# Altium project QUTMS-AltiumCommonProject.PrjPcb
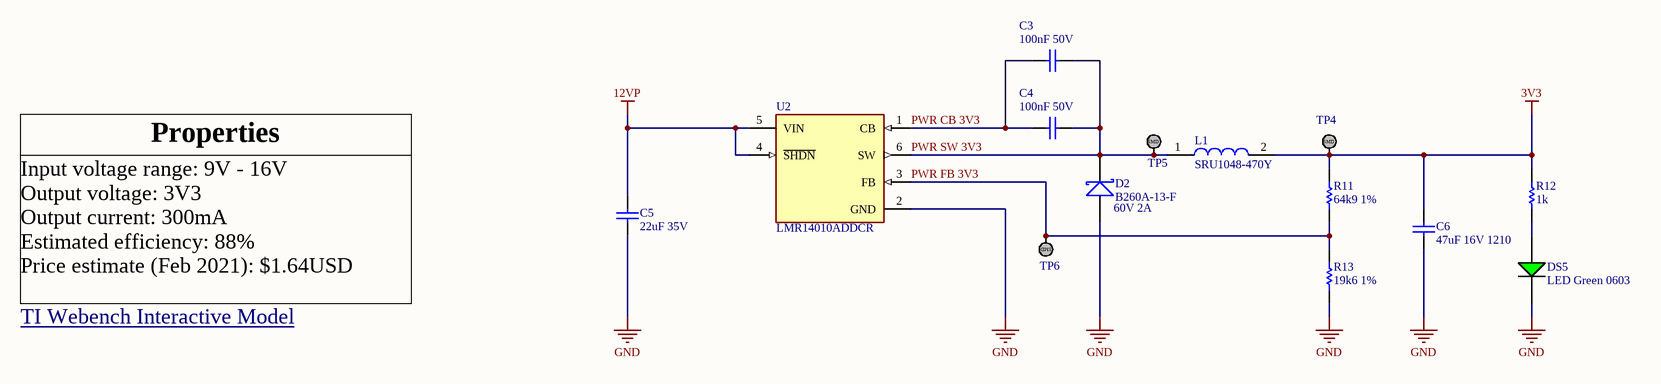
[diagram p0: PSU3V3-300mA.SchDoc]
4 sheets, 64 parts. Net scope: hierarchical (ports join the sheet entries above them; power ports are global).
Sheets:
  PSU3V3-300mA.SchDoc
  PSU5V-400mA.SchDoc
  PSU12V-250mA-Protection.SchDoc
    U_CAN-Transceiver = CAN-Transceiver.SchDoc

## Sheet PSU3V3-300mA.SchDoc: 9-16V to 3V3 - 300mA
size A3; DrawnBy: Tom Benedetti (Based on Jonn Dillon); DocumentNumber: 1; Revision: 03; SheetNumber: 1; SheetTotal: 1; Version: 01; Project: QUTMS Common Altium Schematics; PageSetup: Record=PageOptions|CenterHorizontal=True|CenterVertical=True|PrintScale=0.97|XCorrection=1.00|YCorrection=1.00|PrintKind=0|BorderSize=5000000|LeftOffset=0|BottomOffset=0|Orientation=2|PaperLength=1000|PaperWidth=1000|Scale=100|PaperSource=7|PrintQuality=-4|MediaType=1|DitherType=10|PaperKind=A4|PrintScaleMode=1

### Parts
C3  100nF 50V  [Cap_Ceramic_0603]
C4  100nF 50V  [Cap_Ceramic_0603]
C5  22uF 35V  [Cap_Ceramic_1206]
C6  47uF 16V 1210  [Cap_Ceramic_1210]
D2  B260A-13-F  [SMA]
DS5  LED Green 0603  [LED GREEN 0603]
L1  SRU1048-470Y  [SRU1048]
R11  64k9 1%  [Res_ThinFilm_0603]
R12  1k  [Res_ThinFilm_0603]
R13  19k6 1%  [Res_ThinFilm_0603]
TP4  TestPoint_SMD  [TestPointSMD]  (value not drawn)
TP5  TestPoint_SMD  [TestPointSMD]  (value not drawn)
TP6  TestPoint_SMD  [TestPointSMD]  (value not drawn)
U2  LMR14010ADDCR  [FP-DDC0006A-MFG]

### Nets
3V3: C6.2 L1.2 R11.2 R12.2 TP4.1
12VP: C5.1 U2.4(~{SHDN}) U2.5(VIN)
GND: C5.2 C6.1 D2.A DS5.2(C) R13.1 U2.2(GND)
PWR CB 3V3: C3.1 C4.1 U2.1(CB)
PWR FB 3V3: R11.1 R13.2 TP6.1 U2.3(FB)
PWR SW 3V3: C3.2 C4.2 D2.K L1.1 TP5.1 U2.6(SW)
NetDS5_1: DS5.1(A) R12.1

### Notes on the sheet
- Properties
- (near D2) 60V 2A
- Input voltage range: 9V - 16V
  Output voltage: 3V3
  Output current: 300mA
  Estimated efficiency: 88%
  Price estimate (Feb 2021): $1.64USD
- TI Webench Interactive Model <https://webench.ti.com/power-designer/switching-regulator/customize/16?O1I=0.3&O1V=3.3&VinMax=16.0&VinMin=9.0&action=schematic&base_pn=LMR14010A&lang_chosen=en_US&op_TA=30.0&optFactor=3&origin=ODS__LMR14010A>
- Revision History:
- Sheet Title:
- Rev
- Date
- Description
- Project:
- Size:
- Drawn By:
- A3
- Number:
- Revision:
- Sheet
- Version:
- of
- QUT Motorsport
- O-120, Gardens Point
- 2 George Street
- Brisbane, QLD 4000
- Australia
- Print Date:
- Print Time:
- File Name:
- (in symbol TestPoint_SMD) SMD

### Library data of the parts
C3 C4 = 100nF 50V 5% X7R 0603: Capacitor, Ceramic, SMD, 100nF, 50V, 5%, X7R, 0603
C5 = 22uF 35V 20% X5R 1206: 22µF ±20% 35V Ceramic Capacitor X5R 1206 (3216 Metric); ComponentLink1Description: Digikey; ComponentLink1URL: https://www.digikey.com.au/product-detail/en/tdk-corporation/C3216X5R1V226M160AC/445-8045-1-ND/2792165; ComponentLink2Description: Datasheet; ComponentLink2URL: https://product.tdk.com/info/en/catalog/datasheets/mlcc_commercial_general_en.pdf
C6 = 47uF 16V 10% X7R 1210: Capacitor, Ceramic, SMD, 47uF, 16V, 5%, X7R, 1210
D2 = B260A-13-F: Diode, Schottky Barrier Rectifier, 60 V, 2 A, B260A-13-F
L1 = SRU1048-470Y: Fixed Inductors 47uH 30% SMD 1048
R11 = 64k9 1% 0603: Resistor, SMD, 64k9, 0.1W, 5%, 0603
R12 = 1k 5% 0603: Resistor, SMD, 1k, 0.1W, 5%, 0603
R13 = 19k6 1% 0603: Resistor, SMD, 19k6, 0.1W, 5%, 0603
U2 = CMP-04918-000056-1: IC REG BUCK ADJ 1A TSOT23-6; Manufacturer: Texas Instruments; Max Junction Temp: +125°C; Number Of Outputs: 1; Standoff Height: 0mm; Switching Frequency: 700kHz; Min Supply Voltage: 4V; Max Supply Voltage: 40V; Max Duty Cycle: 96%; Output Type: AdjustableProgrammable; Manufacturer Part Number: LMR14010ADDCR; Temperature: -40°C to +125°C; Output Current: 1A; Category: IC; Temperature Range High: +125°C; Lead Free: Yes; Switching Topology: Buck; Mouser Description: 4-V to 40-V, 1-A Step-Down Converter With High Efficiency Eco-Mode 6-SOT-23-THIN -40 to 125; Device Class L1: Integrated Circuits (ICs); Digikey Description: IC REG BUCK ADJ 1A TSOT23-6; Package: DDC0006A; Ipc Land Pattern Name: SOT95P280X110-6; Device Class L2: Power Management ICs; Temperature Range Low: -40°C; Height: 1.1mm; Device Class L3: Voltage Regulators - Switching; RoHS: TRUE; Automotive: No; Octopart: https://octopart.com/lmr14010addcr-texas+instruments-90753290; ComponentLink2URL: https://www.ti.com/lit/ds/symlink/lmr14010a.pdf; ComponentLink2Description: Datasheet

## Sheet PSU5V-400mA.SchDoc: 9-16V to 5V - 400mA
size A3; DrawnBy: Tom Benedetti (Based on Jonn Dillon); DocumentNumber: N/A; Revision: 02; SheetNumber: 1; SheetTotal: 1; Version: 01; Project: QUTMS Common Altium Schematics; PageSetup: Record=PageOptions|CenterHorizontal=True|CenterVertical=True|PrintScale=0.97|XCorrection=1.00|YCorrection=1.00|PrintKind=0|BorderSize=5000000|LeftOffset=0|BottomOffset=0|Orientation=2|PaperLength=1000|PaperWidth=1000|Scale=100|PaperSource=7|PrintQuality=-4|MediaType=1|DitherType=10|PaperKind=A4|PrintScaleMode=1
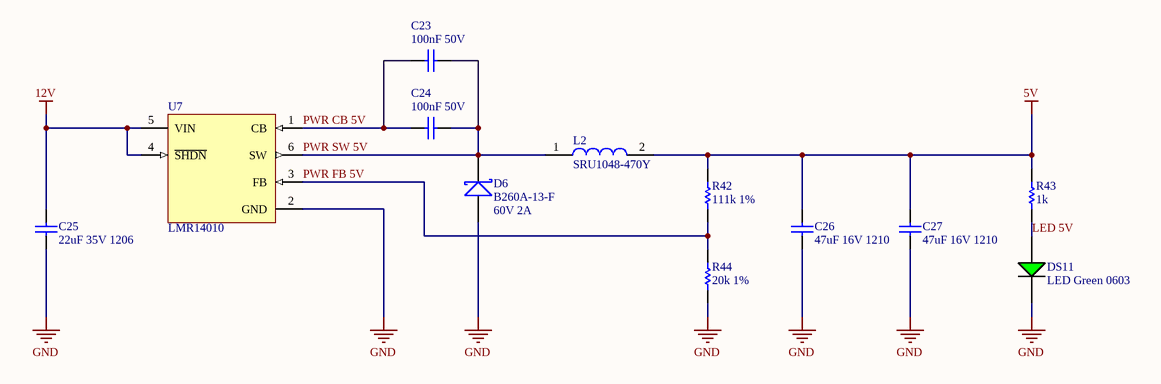
[diagram p1: PSU5V-400mA.SchDoc]

### Parts
C23  100nF 50V  [Cap_Ceramic_0603]
C24  100nF 50V  [Cap_Ceramic_0603]
C25  22uF 35V 1206  [Cap_Ceramic_1206]
C26  47uF 16V 1210  [Cap_Ceramic_1210]
C27  47uF 16V 1210  [Cap_Ceramic_1210]
D6  B260A-13-F  [SMA]
DS11  LED Green 0603  [LED GREEN 0603]
L2  SRU1048-470Y  [SRU1048]
R42  111k 1%  [Res_ThinFilm_0603]
R43  1k  [Res_ThinFilm_0603]
R44  20k 1%  [Res_ThinFilm_0603]
U7  LMR14010  [LMR14010]

### Nets
5V: C26.2 C27.2 L2.2 R42.2 R43.2
12V: C25.2 U7.4(~{SHDN}) U7.5(VIN)
GND: C25.1 C26.1 C27.1 D6.A DS11.2(C) R44.1 U7.2(GND)
LED 5V: DS11.1(A) R43.1
PWR CB 5V: C23.1 C24.1 U7.1(CB)
PWR FB 5V: R42.1 R44.2 U7.3(FB)
PWR SW 5V: C23.2 C24.2 D6.K L2.1 U7.6(SW)

### Notes on the sheet
- (near D6) 60V 2A
- Revision History:
- Sheet Title:
- Rev
- Date
- Description
- Project:
- Size:
- Drawn By:
- A3
- Number:
- Revision:
- Sheet
- Version:
- of
- QUT Motorsport
- O-120, Gardens Point
- 2 George Street
- Brisbane, QLD 4000
- Australia
- Print Date:
- Print Time:
- File Name:

### Library data of the parts
C23 C24 = 100nF 50V 5% X7R 0603: as C3 on sheet PSU3V3-300mA
C25 = 22uF 35V 10% X7R 1206: Capacitor, Ceramic, SMD, 22uF, 35V, 10%, X7R, 1206
C26 C27 = 47uF 16V 10% X7R 1210: as C6 on sheet PSU3V3-300mA
D6 = B260A-13-F: as D2 on sheet PSU3V3-300mA
L2 = SRU1048-470Y: Fixed Inductors 47uH 30% SMD 1048
R42 = 111k 1% 0603: Resistor, SMD, 111k, 0.1W, 5%, 0603
R43 = 1k 5% 0603: Resistor, SMD, 1k, 0.1W, 5%, 0603
R44 = 20k 1% 0603: Resistor, SMD, 20k, 0.1W, 1%, 0603

## Sheet PSU12V-250mA-Protection.SchDoc: 12V 250mA Protection
size A3; DrawnBy: Tom Benedetti; DocumentNumber: N/A; Revision: 3; SheetNumber: 1; SheetTotal: 1; Version: 01; Project: QUTMS Common Altium Schematics; PageSetup: Record=PageOptions|CenterHorizontal=True|CenterVertical=True|PrintScale=0.97|XCorrection=1.00|YCorrection=1.00|PrintKind=0|BorderSize=5000000|LeftOffset=0|BottomOffset=0|Orientation=2|PaperLength=1000|PaperWidth=1000|Scale=100|PaperSource=7|PrintQuality=-4|MediaType=1|DitherType=10|PaperKind=A4|PrintScaleMode=1
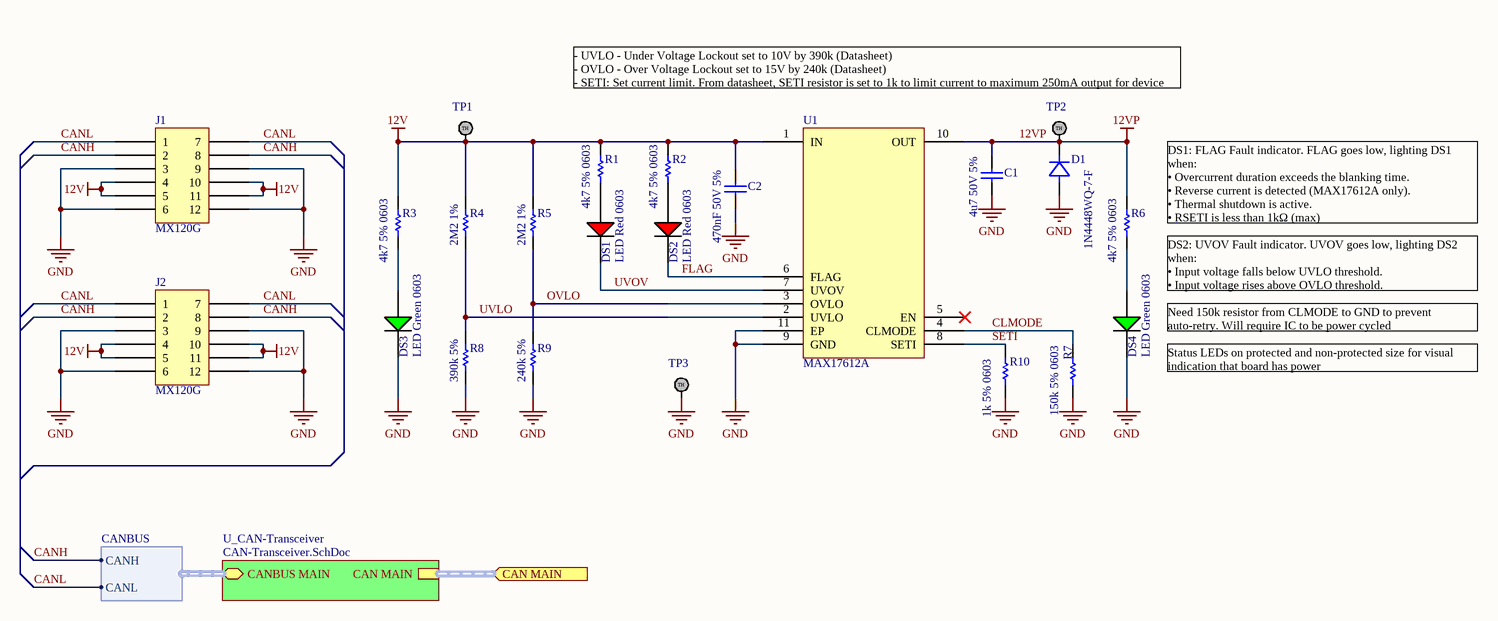
[diagram p2: PSU12V-250mA-Protection.SchDoc]

### Parts
C1  4u7 50V 5%  [Cap_Ceramic_0603]
C2  470nF 50V 5%  [Cap_Ceramic_0603]
D1  1N4448WQ-7-F  [SMA]
DS1  LED Red 0603  [LED RED 0603]
DS2  LED Red 0603  [LED RED 0603]
DS3  LED Green 0603  [LED GREEN 0603]
DS4  LED Green 0603  [LED GREEN 0603]
J1  MX120G  [MX120G]
J2  MX120G  [MX120G]
R1  4k7 5% 0603  [Res_ThinFilm_0603]
R2  4k7 5% 0603  [Res_ThinFilm_0603]
R3  4k7 5% 0603  [Res_ThinFilm_0603]
R4  2M2 1%  [Res_ThinFilm_0603]
R5  2M2 1%  [Res_ThinFilm_0603]
R6  4k7 5% 0603  [Res_ThinFilm_0603]
R7  150k 5% 0603  [Res_ThinFilm_0603]
R8  390k 5%  [Res_ThinFilm_0603]
R9  240k 5%  [Res_ThinFilm_0603]
R10  1k 5% 0603  [Res_ThinFilm_0603]
TP1  TestPoint  [TestPoint]  (value not drawn)
TP2  TestPoint  [TestPoint]  (value not drawn)
TP3  TestPoint  [TestPoint]  (value not drawn)
U1  MAX17612A  [10-Pin TDFN EP]

### Sub-sheets
U_CAN-Transceiver = CAN-Transceiver.SchDoc: CANBUS MAIN (bidir, harness CANBUS), CAN MAIN (harness CAN)

### Ports
CAN MAIN (in)

### Harnesses
CANBUS: CANH, CANL

### Nets
12V: C2.2 J1.4 J1.5 J1.10 J1.11 J2.4 J2.5 J2.10 J2.11 R1.2 R2.2 R3.2 R4.2 R5.2 TP1.1 U1.1(IN)
12VP: C1.2 D1.K(Cathode) R6.2 TP2.1 U1.10(OUT)
GND: C1.1 C2.1 D1.A(Anode) DS3.2(C) DS4.2(C) J1.3 J1.6 J1.9 J1.12 J2.3 J2.6 J2.9 J2.12 R7.1 R8.1 R9.1 R10.1 TP3.1 U1.9(GND) U1.11(EP)
CANH: J1.2 J1.8 J2.2 J2.8 ; sheet U_CAN-Transceiver/CANBUS MAIN.CANH
CANL: J1.1 J1.7 J2.1 J2.7 ; sheet U_CAN-Transceiver/CANBUS MAIN.CANL
CLMODE: R7.2 U1.4(CLMODE)
FLAG: DS2.2(C) U1.6(FLAG)
OVLO: R5.1 R9.2 U1.3(OVLO)
SETI: R10.2 U1.8(SETI)
UVLO: R4.1 R8.2 U1.2(UVLO)
UVOV: DS1.2(C) U1.7(UVOV)
NetDS1_1: DS1.1(A) R1.1
NetDS2_1: DS2.1(A) R2.1
NetDS3_1: DS3.1(A) R3.1
NetDS4_1: DS4.1(A) R6.1

Not connected (* = marked no-connect by the designer): U1 5(EN)*

### Buses and harness runs
harness port CAN MAIN = sheet U_CAN-Transceiver/CAN MAIN

### Notes on the sheet
- - UVLO - Under Voltage Lockout set to 10V by 390k (Datasheet)
  - OVLO - Over Voltage Lockout set to 15V by 240k (Datasheet)
  - SETI: Set current limit. From datasheet, SETI resistor is set to 1k to limit current to maximum 250mA output for device
- (near R6) DS1: FLAG Fault indicator. FLAG goes low, lighting DS1 when:
  • Overcurrent duration exceeds the blanking time.
  • Reverse current is detected (MAX17612A only).
  • Thermal shutdown is active.
  • RSETI is less than 1kΩ (max)
- DS2: UVOV Fault indicator. UVOV goes low, lighting DS2 when:
  • Input voltage falls below UVLO threshold.
  • Input voltage rises above OVLO threshold.
- (near DS4) Need 150k resistor from CLMODE to GND to prevent auto-retry. Will require IC to be power cycled
- (near DS4) Status LEDs on protected and non-protected size for visual indication that board has power
- Revision History:
- Sheet Title:
- Rev
- Date
- Description
- Project:
- Size:
- Drawn By:
- A3
- Number:
- Revision:
- Sheet
- Version:
- of
- QUT Motorsport
- O-120, Gardens Point
- 2 George Street
- Brisbane, QLD 4000
- Australia
- Print Date:
- Print Time:
- File Name:
- (in symbol TestPoint) TH

### Library data of the parts
C1 = 4u7 50V 5% X7R 0603: Capacitor, Ceramic, SMD, 4u7, 50V, 5%, X7R, 0603
C2 = 470nF 50V 5% X7R 0603: Capacitor, Ceramic, SMD, 470nF, 50V, 5%, X7R, 0603
D1 = 1N4448WQ-7-F: Diode, SMD, 75V, 5%, 250mA, SOD123; Manufacturer: ON Semiconductor / Fairchild; Manufacturer Part Number: 1N914BWS; Average Rectified Current: 150mA; Element Configuration: Single; Forward Voltage: 1V; Max Reverse Leakage Current: 5uA; Power Dissipation: 200mW; Recovery Time: 4ns; Max Forward Surge Current (Ifsm): 4A; Parameter 1: *; Weight: 0.0276g; Category: Rectifier Diodes; Contact Plating: Tin,Matte; Forward Current: 150mA; Lead Free: Lead Free; Max Operating Temperature: 150°C; Max Repetitive Reverse Voltage (Vrrm): 75V; Max Reverse Voltage (DC): 75V; Min Operating Temperature: -55°C; Mount: Surface Mount; Number of Pins: 2; Package Quantity: 1; Packaging: Tape and Reel; Peak Reverse Current: 5uA; Radiation Hardening: No; REACH SVHC: No SVHC; Reverse Recovery Time: 4ns; Height: 1mm; Length: 1.8mm; Reverse Voltage: 75V; Width: 1.35mm
J1 J2 = MX120G: MX120G with standard connector layout
R1-R3 R6 = 4k7 5% 0603: Resistor, SMD, 4k7, 0.1W, 5%, 0603
R4 R5 = 2M2 1% 0603: Resistor, SMD, 2M2, 0.125W, 1%, 0603
R7 = 150k 5%, 0603: Resistor, SMD, 150k, 0.1W, 5%, 0603
R8 = 390k 5% 0603: Resistor, SMD, 390k, 0.1W, 5%, 0603
R9 = 240k 5% 0603: Resistor, SMD, 240k, 0.1W, 5%, 0603
R10 = 1k 5% 0603: Resistor, SMD, 1k, 0.1W, 5%, 0603
U1 = MAX17612A: 4.5V to 60V, 250mA Current-Limiter with OV, UV, and Reverse Protection; ComponentLink1Description: Datasheet; ComponentLink1URL: https://datasheets.maximintegrated.com/en/ds/MAX17612A-MAX17612C.pdf

## Sheet CAN-Transceiver.SchDoc: CAN Transceiver 3V3
size A3; DrawnBy: Jonn Dillon; DocumentNumber: N/A; Revision: 02; SheetNumber: 1; SheetTotal: 1; Version: 01; Project: QUTMS Common Altium Schematics; PageSetup: Record=PageOptions|CenterHorizontal=True|CenterVertical=True|PrintScale=0.97|XCorrection=1.00|YCorrection=1.00|PrintKind=0|BorderSize=5000000|LeftOffset=0|BottomOffset=0|Orientation=2|PaperLength=1000|PaperWidth=1000|Scale=100|PaperSource=7|PrintQuality=-4|MediaType=1|DitherType=10|PaperKind=A4|PrintScaleMode=1
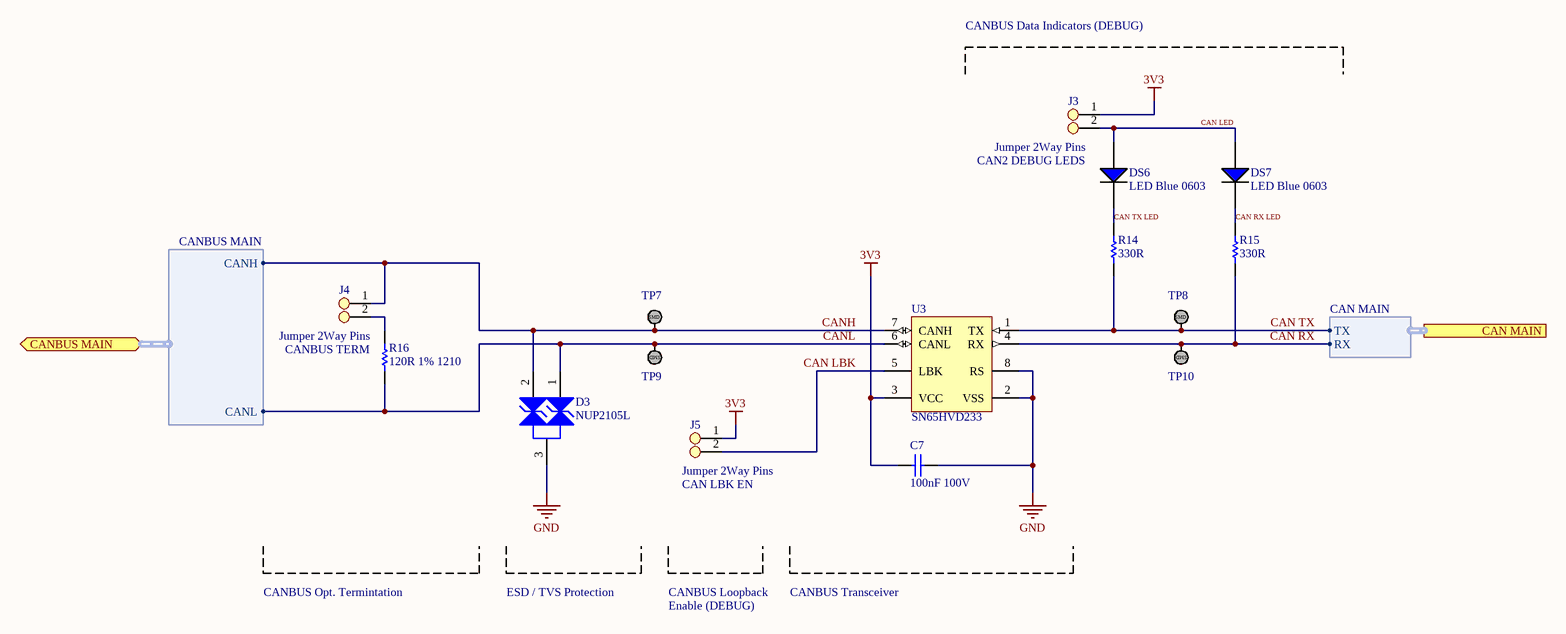
[diagram p3: CAN-Transceiver.SchDoc]

### Parts
C7  100nF 100V  [Cap_Ceramic_0603]
D3  NUP2105L  [NUP2105L]
DS6  LED Blue 0603  [LED BLUE 0603]
DS7  LED Blue 0603  [LED BLUE 0603]
J3  Jumper 2Way Pins  [Jumper_2Way_Pin]
J4  Jumper 2Way Pins  [Jumper_2Way_Pin]
J5  Jumper 2Way Pins  [Jumper_2Way_Pin]
R14  330R  [Res_ThinFilm_0603]
R15  330R  [Res_ThinFilm_0603]
R16  120R 1% 1210  [Res_ThinFilm_1210]
TP7  TestPoint_SMD  [TestPointSMD]  (value not drawn)
TP8  TestPoint_SMD  [TestPointSMD]  (value not drawn)
TP9  TestPoint_SMD  [TestPointSMD]  (value not drawn)
TP10  TestPoint_SMD  [TestPointSMD]  (value not drawn)
U3  SN65HVD233  [SN65HVD233DR]

### Ports
CAN MAIN (harness CAN MAIN), CANBUS MAIN (bidir, harness CANBUS MAIN)

### Harnesses
CANBUS MAIN: CANH, CANL
CAN MAIN: RX, TX

### Nets
3V3: C7.2 J3.1 J5.1 U3.3(VCC)
GND: C7.1 D3.3 U3.2(VSS) U3.8(RS)
CAN LBK: J5.2 U3.5(LBK)
CAN LED: DS6.1(A) DS7.1(A) J3.2
CAN RX: R15.1 TP10.1 U3.4(RX) ; port CAN MAIN.RX
CAN RX LED: DS7.2(C) R15.2
CAN TX: R14.1 TP8.1 U3.1(TX) ; port CAN MAIN.TX
CAN TX LED: DS6.2(C) R14.2
CANH: D3.2 J4.1 TP7.1 U3.7(CANH) ; port CANBUS MAIN.CANH
CANL: D3.1 R16.1 TP9.1 U3.6(CANL) ; port CANBUS MAIN.CANL
NetJ4_2: J4.2 R16.2

### Notes on the sheet
- CANBUS Data Indicators (DEBUG)
- CAN2 DEBUG LEDS
- (near R16) CANBUS TERM
- (near J5) CAN LBK EN
- CANBUS Opt. Termintation
- ESD / TVS Protection
- CANBUS Loopback
- Enable (DEBUG)
- CANBUS Transceiver
- Revision History:
- Sheet Title:
- Rev
- Date
- Description
- Project:
- Size:
- Drawn By:
- A3
- Number:
- Revision:
- Sheet
- Version:
- of
- QUT Motorsport
- O-120, Gardens Point
- 2 George Street
- Brisbane, QLD 4000
- Australia
- Print Date:
- Print Time:
- File Name:
- (in symbol TestPoint_SMD) SMD

### Library data of the parts
C7 = 100nF 100V 5% X7R 0603: Capacitor, Ceramic, SMD, 100nF, 100V, 5%, X7R, 0603
J3-J5 = Jumper 2Way Side Pins
R14 R15 = 330R 5% 0603: Resistor, SMD, 330R, 0.1W, 5%, 0603
R16 = 120R 1% 1210: Resistor, SMD, 120R, 0.25W, 1%, 1210
D3 = NUP2105L: ComponentLink1Description: Datasheet; ComponentLink1URL: https://www.onsemi.cn/PowerSolutions/document/NUP2105L-D.PDF; Parameter 1: *; ComponentLink2Description: LCSC; ComponentLink2URL: https://lcsc.com/product-detail/TVS_ON-Semiconductor-NUP2105LT1G_C14486.html; ComponentLink3Description: Digikey; ComponentLink3URL: https://www.digikey.com.au/product-detail/en/on-semiconductor/SZNUP2105LT1G/SZNUP2105LT1GOSCT-ND/3487669
U3 = SN65HVD233: ComponentLink1Description: LCSC; ComponentLink1URL: https://lcsc.com/product-detail/CAN-ICs_Texas-Instruments_SN65HVD233DRG4_Texas-Instruments-Texas-Instruments-SN65HVD233DRG4_C61643.html; ComponentLink2Description: Digikey; ComponentLink2URL: https://www.digikey.com.au/product-detail/en/texas-instruments/SN65HVD233DR/296-35967-1-ND/4134960; ComponentLink3Description: Datasheet; ComponentLink3URL: https://www.ti.com/lit/ds/symlink/sn65hvd233.pdf?ts=1588560888178; ComponentLink4Description: Ti Product Page; ComponentLink4URL: https://www.ti.com/product/SN65HVD233

## Nets that join several sheets
3V3: PSU3V3-300mA (5 pins), CAN-Transceiver (C7.2 J3.1 J5.1 U3.3)
12V: PSU5V-400mA (C25.2 U7.4 U7.5), PSU12V-250mA-Protection (16 pins)
12VP: PSU3V3-300mA (C5.1 U2.4 U2.5), PSU12V-250mA-Protection (5 pins)
GND: PSU3V3-300mA (6 pins), PSU5V-400mA (7 pins), PSU12V-250mA-Protection (20 pins), CAN-Transceiver (C7.1 D3.3 U3.2 U3.8)
CANH: PSU12V-250mA-Protection (J1.2 J1.8 J2.2 J2.8), CAN-Transceiver (D3.2 J4.1 TP7.1 U3.7)
CANL: PSU12V-250mA-Protection (J1.1 J1.7 J2.1 J2.7), CAN-Transceiver (D3.1 R16.1 TP9.1 U3.6)